# Altium schematic sheet MC_stm32.SchDoc
size 420 x 297 mm; SheetNumber: 2; SheetTotal: 3
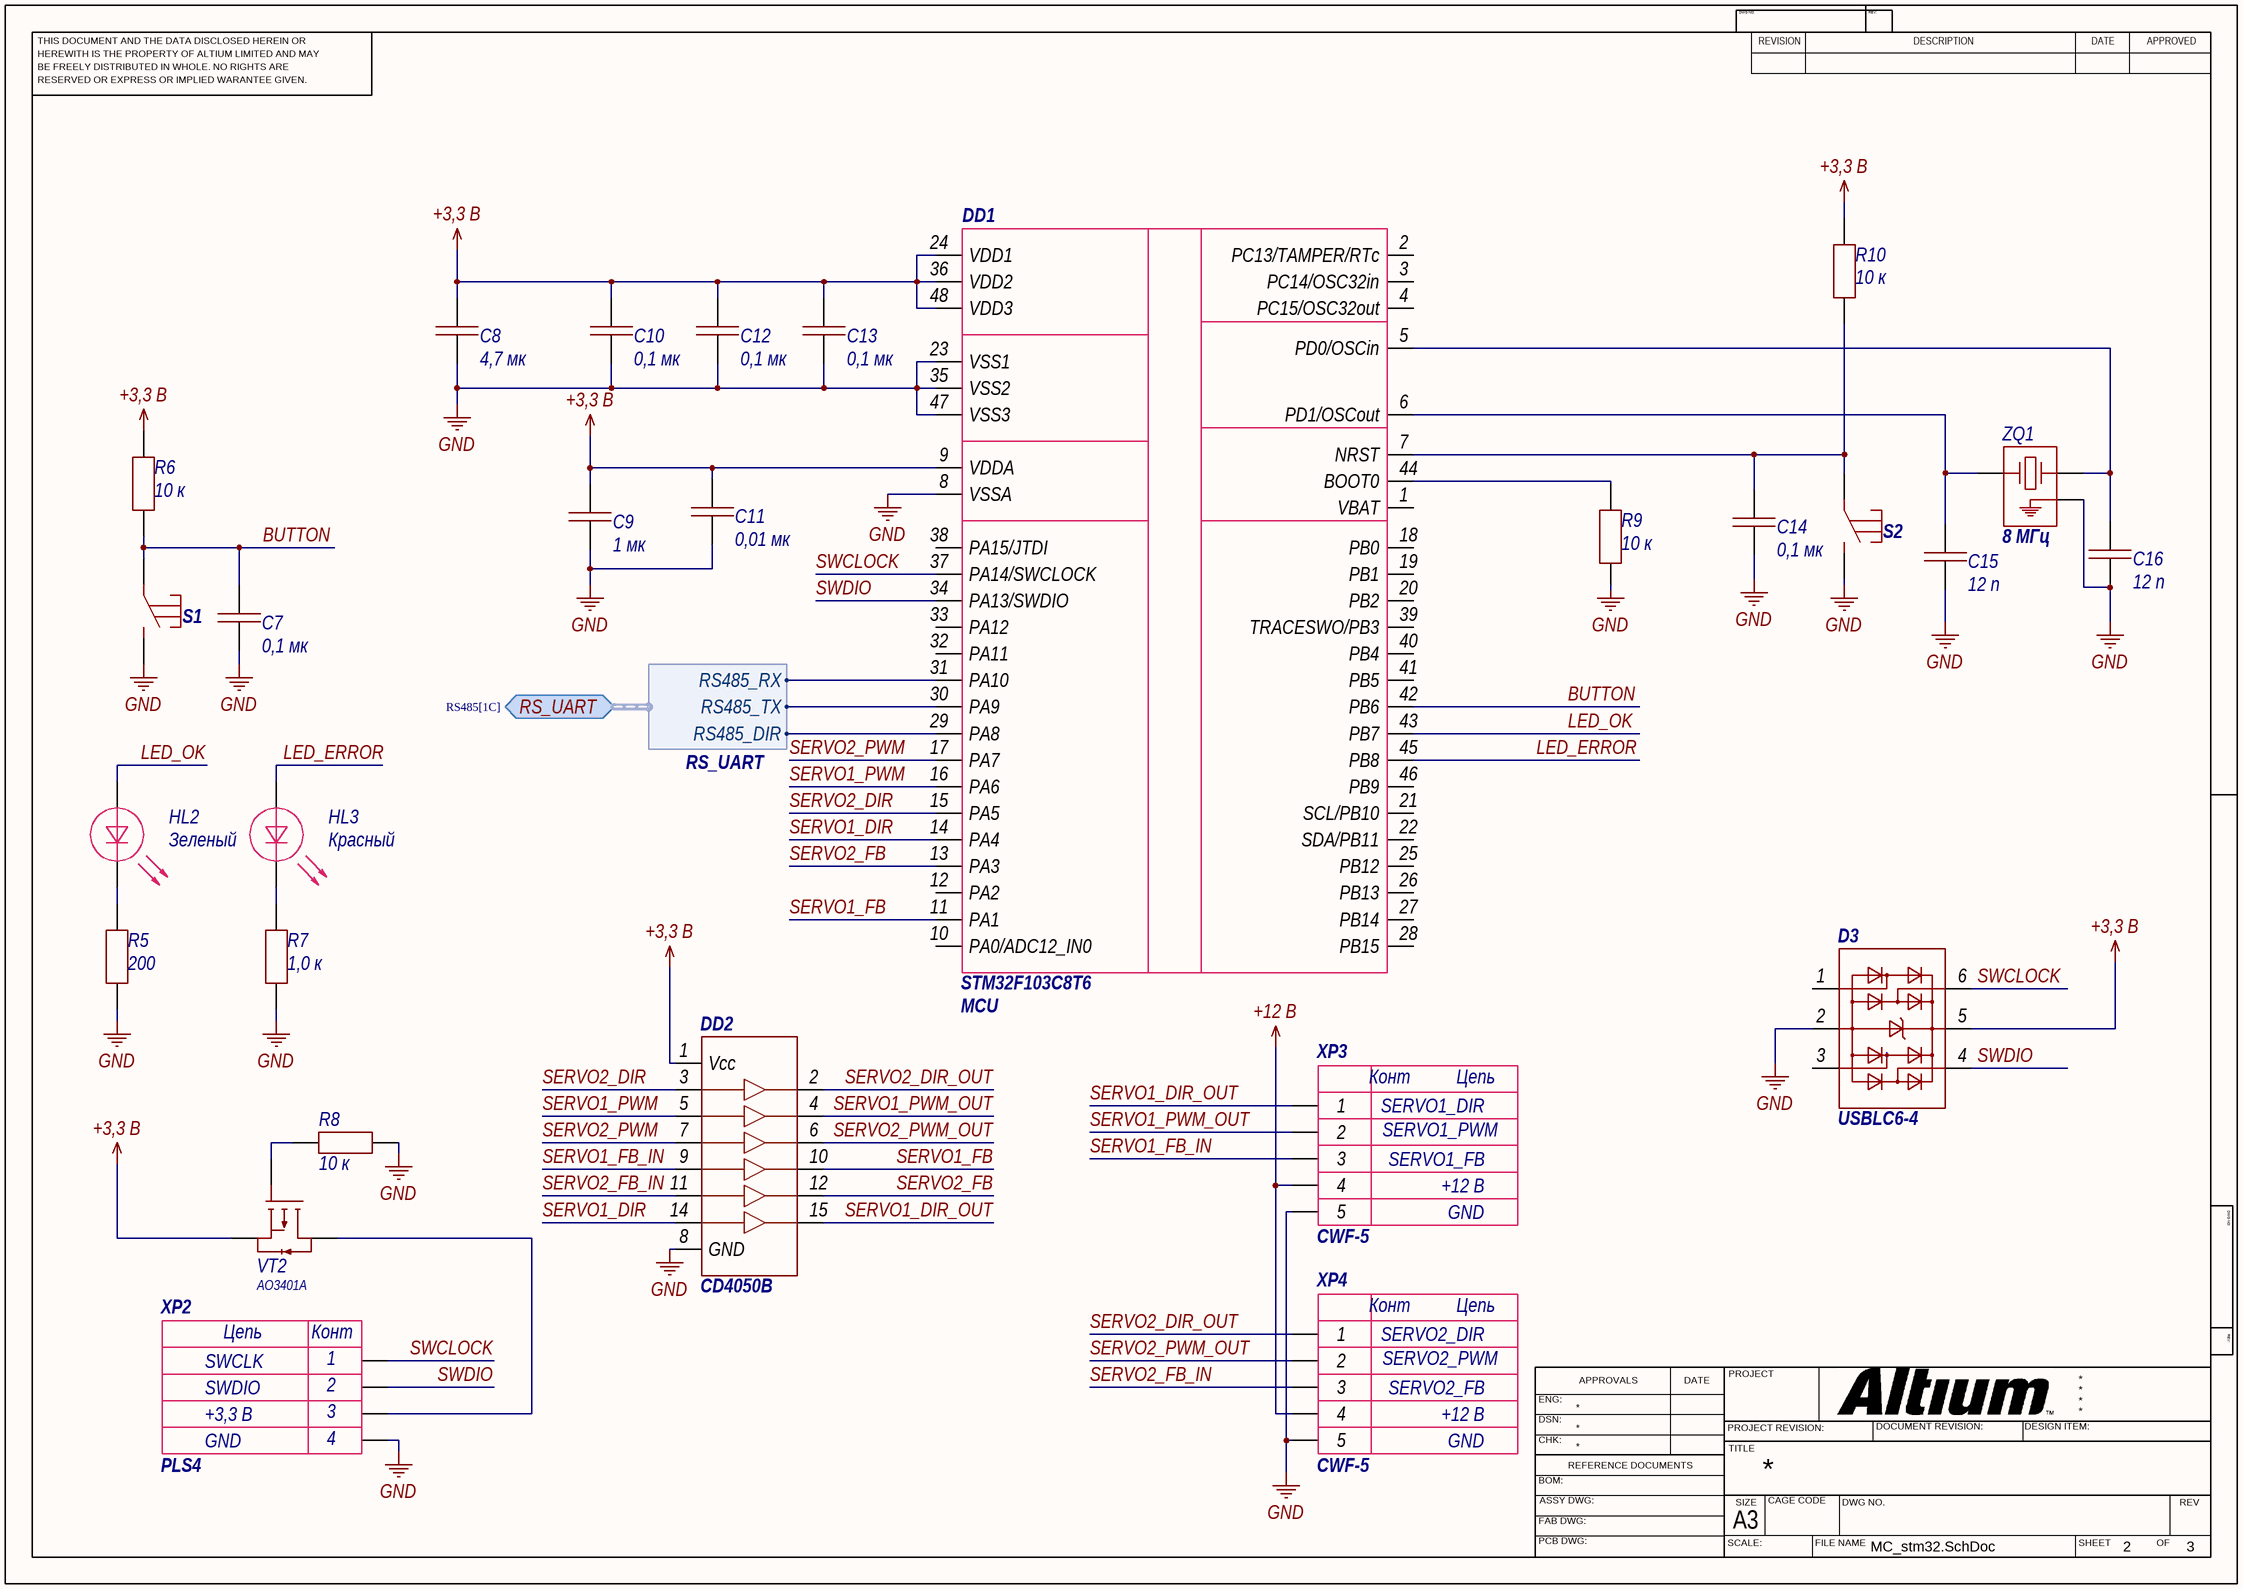
[diagram p0: MC_stm32.SchDoc]

## Parts
C7  value 0,1 мк  [0603C]  (hidden comment: Capacitor)
C8  value 4,7 мк  [1206C]  (hidden comment: Capacitor)
C9  value 1 мк  [0603C]  (hidden comment: Capacitor)
C10  value 0,1 мк  [0603C]  (hidden comment: Capacitor)
C11  value 0,01 мк  [0603C]  (hidden comment: Capacitor)
C12  value 0,1 мк  [0603C]  (hidden comment: Capacitor)
C13  value 0,1 мк  [0603C]  (hidden comment: Capacitor)
C14  value 0,1 мк  [0603C]  (hidden comment: Capacitor)
C15  value 12 п  [0603C]  (hidden comment: Capacitor)
C16  value 12 п  [0603C]  (hidden comment: Capacitor)
D3  USBLC6-4  [SOT23-6]
DD1  STM32F103C8T6  Value1: MCU  [LQFP48]
DD2  CD4050B  [SOIC-16]
HL2  Color: Зеленый  [0805D]  (hidden comment: LED)
HL3  Color: Красный  [0805D]  (hidden comment: LED)
R5  value 200  [0603R]  (hidden comment: Resistor)
R6  value 10 к  [0603R]  (hidden comment: Resistor)
R7  value 1,0 к  [0603R]  (hidden comment: Resistor)
R8  value 10 к  [0603R]  (hidden comment: Resistor)
R9  value 10 к  [0603R]  (hidden comment: Resistor)
R10  value 10 к  [0603R]  (hidden comment: Resistor)
S1  Tact_button  [Button_SMD_10mm]  (value not drawn)
S2  Tact_button  [Button_SMD_10mm]  (value not drawn)
VT2  AO3401A  [SOT23-3]
XP2  PLS4  Value3: +3,3 В  Value2: SWDIO  Value4: GND  Value1: SWCLK  [PLS4]
XP3  CWF-5  Value2: SERVO1_PWM  Value3: SERVO1_FB  Value4: +12 В  Value5: GND  [CWF-5]
XP4  CWF-5  Value1: SERVO2_DIR  Value2: SERVO2_PWM  Value3: SERVO2_FB  Value4: +12 В  Value5: GND  [CWF-5]
ZQ1  value 8 МГц  [QSMD3.2x2.5]  (hidden comment: XTAL_GND)

## Ports
RS_UART (bidir, harness RS_UART, see RS485[1C])

## Harnesses
RS_UART: RS485_TX, RS485_DIR, RS485_RX

## Nets
+3,3 В: C8.1 C9.2 C10.2 C11.2 C12.2 C13.2 D3.5 DD1.9(VDDA) DD1.24(VDD1) DD1.36(VDD2) DD1.48(VDD3) DD2.1(Vcc) R6.1 R10.2 VT2.2
+12 В: XP3.4 XP4.4
GND: C7.1 C8.2 C9.1 C10.1 C11.1 C12.1 C13.1 C14.1 C15.2 C16.2 D3.2 DD1.8(VSSA) DD1.23(VSS1) DD1.35(VSS2) DD1.47(VSS3) DD2.8(GND) R5.2 R7.2 R8.2 R9.2 S1.2 S2.2 XP2.4 XP3.5 XP4.5 ZQ1.3
BUTTON: C7.2 DD1.42(PB6) R6.2 S1.1
LED_ERROR: DD1.45(PB8) HL3.1
LED_OK: DD1.43(PB7) HL2.1
SERVO1_DIR: DD1.14(PA4) DD2.14(A6)
SERVO1_DIR_OUT: DD2.15(Y6) XP3.1
SERVO1_FB: DD1.11(PA1) DD2.10(Y10)
SERVO1_FB_IN: DD2.9(A4) XP3.3
SERVO1_PWM: DD1.16(PA6) DD2.5(A2)
SERVO1_PWM_OUT: DD2.4(Y2) XP3.2
SERVO2_DIR: DD1.15(PA5) DD2.3(A1)
SERVO2_DIR_OUT: DD2.2(Y1) XP4.1
SERVO2_FB: DD1.13(PA3) DD2.12(Y5)
SERVO2_FB_IN: DD2.11(A5) XP4.3
SERVO2_PWM: DD1.17(PA7) DD2.7(A3)
SERVO2_PWM_OUT: DD2.6(Y3) XP4.2
SWCLOCK: D3.6 DD1.37(PA14/SWCLOCK) XP2.1
SWDIO: D3.4 DD1.34(PA13/SWDIO) XP2.2
NetC14_2: C14.2 DD1.7(NRST) R10.1 S2.1
NetC15_1: C15.1 DD1.6(PD1/OSCout) ZQ1.1
NetC16_1: C16.1 DD1.5(PD0/OSCin) ZQ1.2
NetDD1_29: DD1.29(PA8) ; port RS_UART.RS485_DIR
NetDD1_30: DD1.30(PA9) ; port RS_UART.RS485_TX
NetDD1_31: DD1.31(PA10) ; port RS_UART.RS485_RX
NetDD1_44: DD1.44(BOOT0) R9.1
NetHL2_2: HL2.2 R5.1
NetHL3_2: HL3.2 R7.1
NetR8_1: R8.1 VT2.1
NetVT2_3: VT2.3 XP2.3

Not connected (* = marked no-connect by the designer): D3 1(9) 3(11); DD1 1(VBAT) 2(PC13/TAMPER/RTc) 3(PC14/OSC32in) 4(PC15/OSC32out) 10(PA0/ADC12_IN0) 12(PA2) 18(PB0) 19(PB1) 20(PB2) 21(SCL/PB10) 22(SDA/PB11) 25(PB12) 26(PB13) 27(PB14) 28(PB15) 32(PA11) 33(PA12) 38(PA15/JTDI) 39(TRACESWO/PB3) 40(PB4) 41(PB5) 46(PB9)

## Notes on the sheet
- THIS DOCUMENT AND THE DATA DISCLOSED HEREIN OR
- HEREWITH IS THE PROPERTY OF ALTIUM LIMITED AND MAY
- DWG NO:
- REVISION
- REV:
- DESCRIPTION
- DATE
- APPROVED
- BE FREELY DISTRIBUTED IN WHOLE. NO RIGHTS ARE
- RESERVED OR EXPRESS OR IMPLIED WARANTEE GIVEN.
- ENG:
- APPROVALS
- PROJECT
- DSN:
- CHK:
- REFERENCE DOCUMENTS
- PROJECT REVISION:
- TITLE
- DOCUMENT REVISION:
- DESIGN ITEM:
- BOM:
- FAB DWG:
- PCB DWG:
- ASSY DWG:
- SCALE:
- A3
- SIZE
- CAGE CODE
- FILE NAME
- DWG NO.
- SHEET
- OF
- REV
- (in symbol CWF-5) Конт; Цепь
- (in symbol PLS4) Цепь; Конт

## Library data of the parts
C7 C10 C12-C14 = Capacitor_0,1u_10_50V_X7R_0603C: Конденсатор; Tolerance: 0,1; Voltage (V): 50; Dielectric: X7R; Capacity (nF): 100; Part Number: Capacitor_0,1u_10_50V_X7R_0603C
C8 = Capacitor_4,7u_10_50V_X7R_1206C: Конденсатор; Tolerance: 0,1; Voltage (V): 50; Dielectric: X7R; Capacity (nF): 4700; Part Number: Capacitor_4,7u_10_50V_X7R_1206C
C9 = Capacitor_1u_10_50V_X7R_0603C: Конденсатор; Tolerance: 0,1; Voltage (V): 50; Dielectric: X7R; Capacity (nF): 1000; Part Number: Capacitor_1u_10_50V_X7R_0603C
C11 = Capacitor_10n_10_50V_X7R_0603C: Конденсатор; Tolerance: 0,1; Voltage (V): 50; Dielectric: X7R; Capacity (nF): 10; Part Number: Capacitor_10n_10_50V_X7R_0603C
C15 C16 = 0,1 мк: Конденсатор; Part Number: Capacitor
D3 = USBLC6-4: Сборка защитных диодов для USB; ComponentLink1Description: Shop; ComponentLink1URL: https://www.chipdip.ru/product0/8001780508; Part Number: USBLC6-4
DD1 = STM32F103C8T6: Микроконтроллер; Manufacturer: ST Microelectronics; Rate: -0,3...4,0В; Shop: магазин с самой дешевой ценой; Notice: 48 пиновая версия STM32F103; Datasheet: http://www.st.com/content/ccc/resource/technical/document/datasheet/33/d4/6f/1d/df/0b/4c/6d/CD00161566.pdf/files/CD00161566.pdf/jcr:content/translations/en.CD00161566.pdf; Case: корпус; Part Number: STM32F103C8T6
DD2 = CD4050B: Шесть буферных элементов; Part Number: CD4050B
HL2 HL3 = LED: Светодиод; Part Number: LED
R5 = Resistor_200_1_0603: Резистор номиналом 200 Ом и точностью 1%; Power: *; Part Number: Resistor_200_1_0603; Tolerance: 1%
R6 R8-R10 = Resistor_10k_1_0603: Резистор номиналом 10 кОм и точностью 1%; Power: *; Part Number: Resistor_10k_1_0603; Tolerance: 1%
R7 = Resistor_1.0k_1_0603: Резистор номиналом 1,0 кОм и точностью 1%; Power: *; Part Number: Resistor_1.0k_1_0603; Tolerance: 1%
S1 S2 = Tact_button: Тактовая кнопка; Part Number: Tact_button
VT2 = AO3401A: P-канальный MOSFET; Part Number: AO3401A
XP2 = PLS4: Гребенка 4 пина; Part Number: PLS4
XP3 XP4 = CWF-5: 5-пиновый разъем с ключом; Part Number: CWF-5
  XP3: SERVO1_DIR: SERVO1_DIR
ZQ1 = XTAL_GND: WTL3M85421FO, Резонатор кварцевый 8МГц, 10PPM при 25°C, 20PPM при -40°С+85°C, 400Ом, 12пФ; Part Number: XTAL_GND